# EasyEDA schematic Sheet_1.json
TITLE: Sheet_1; REV: 1.0; Date: 2024-01-25; Sheet: 1/1; Drawn By: reyessanchezo; Company: Your Company
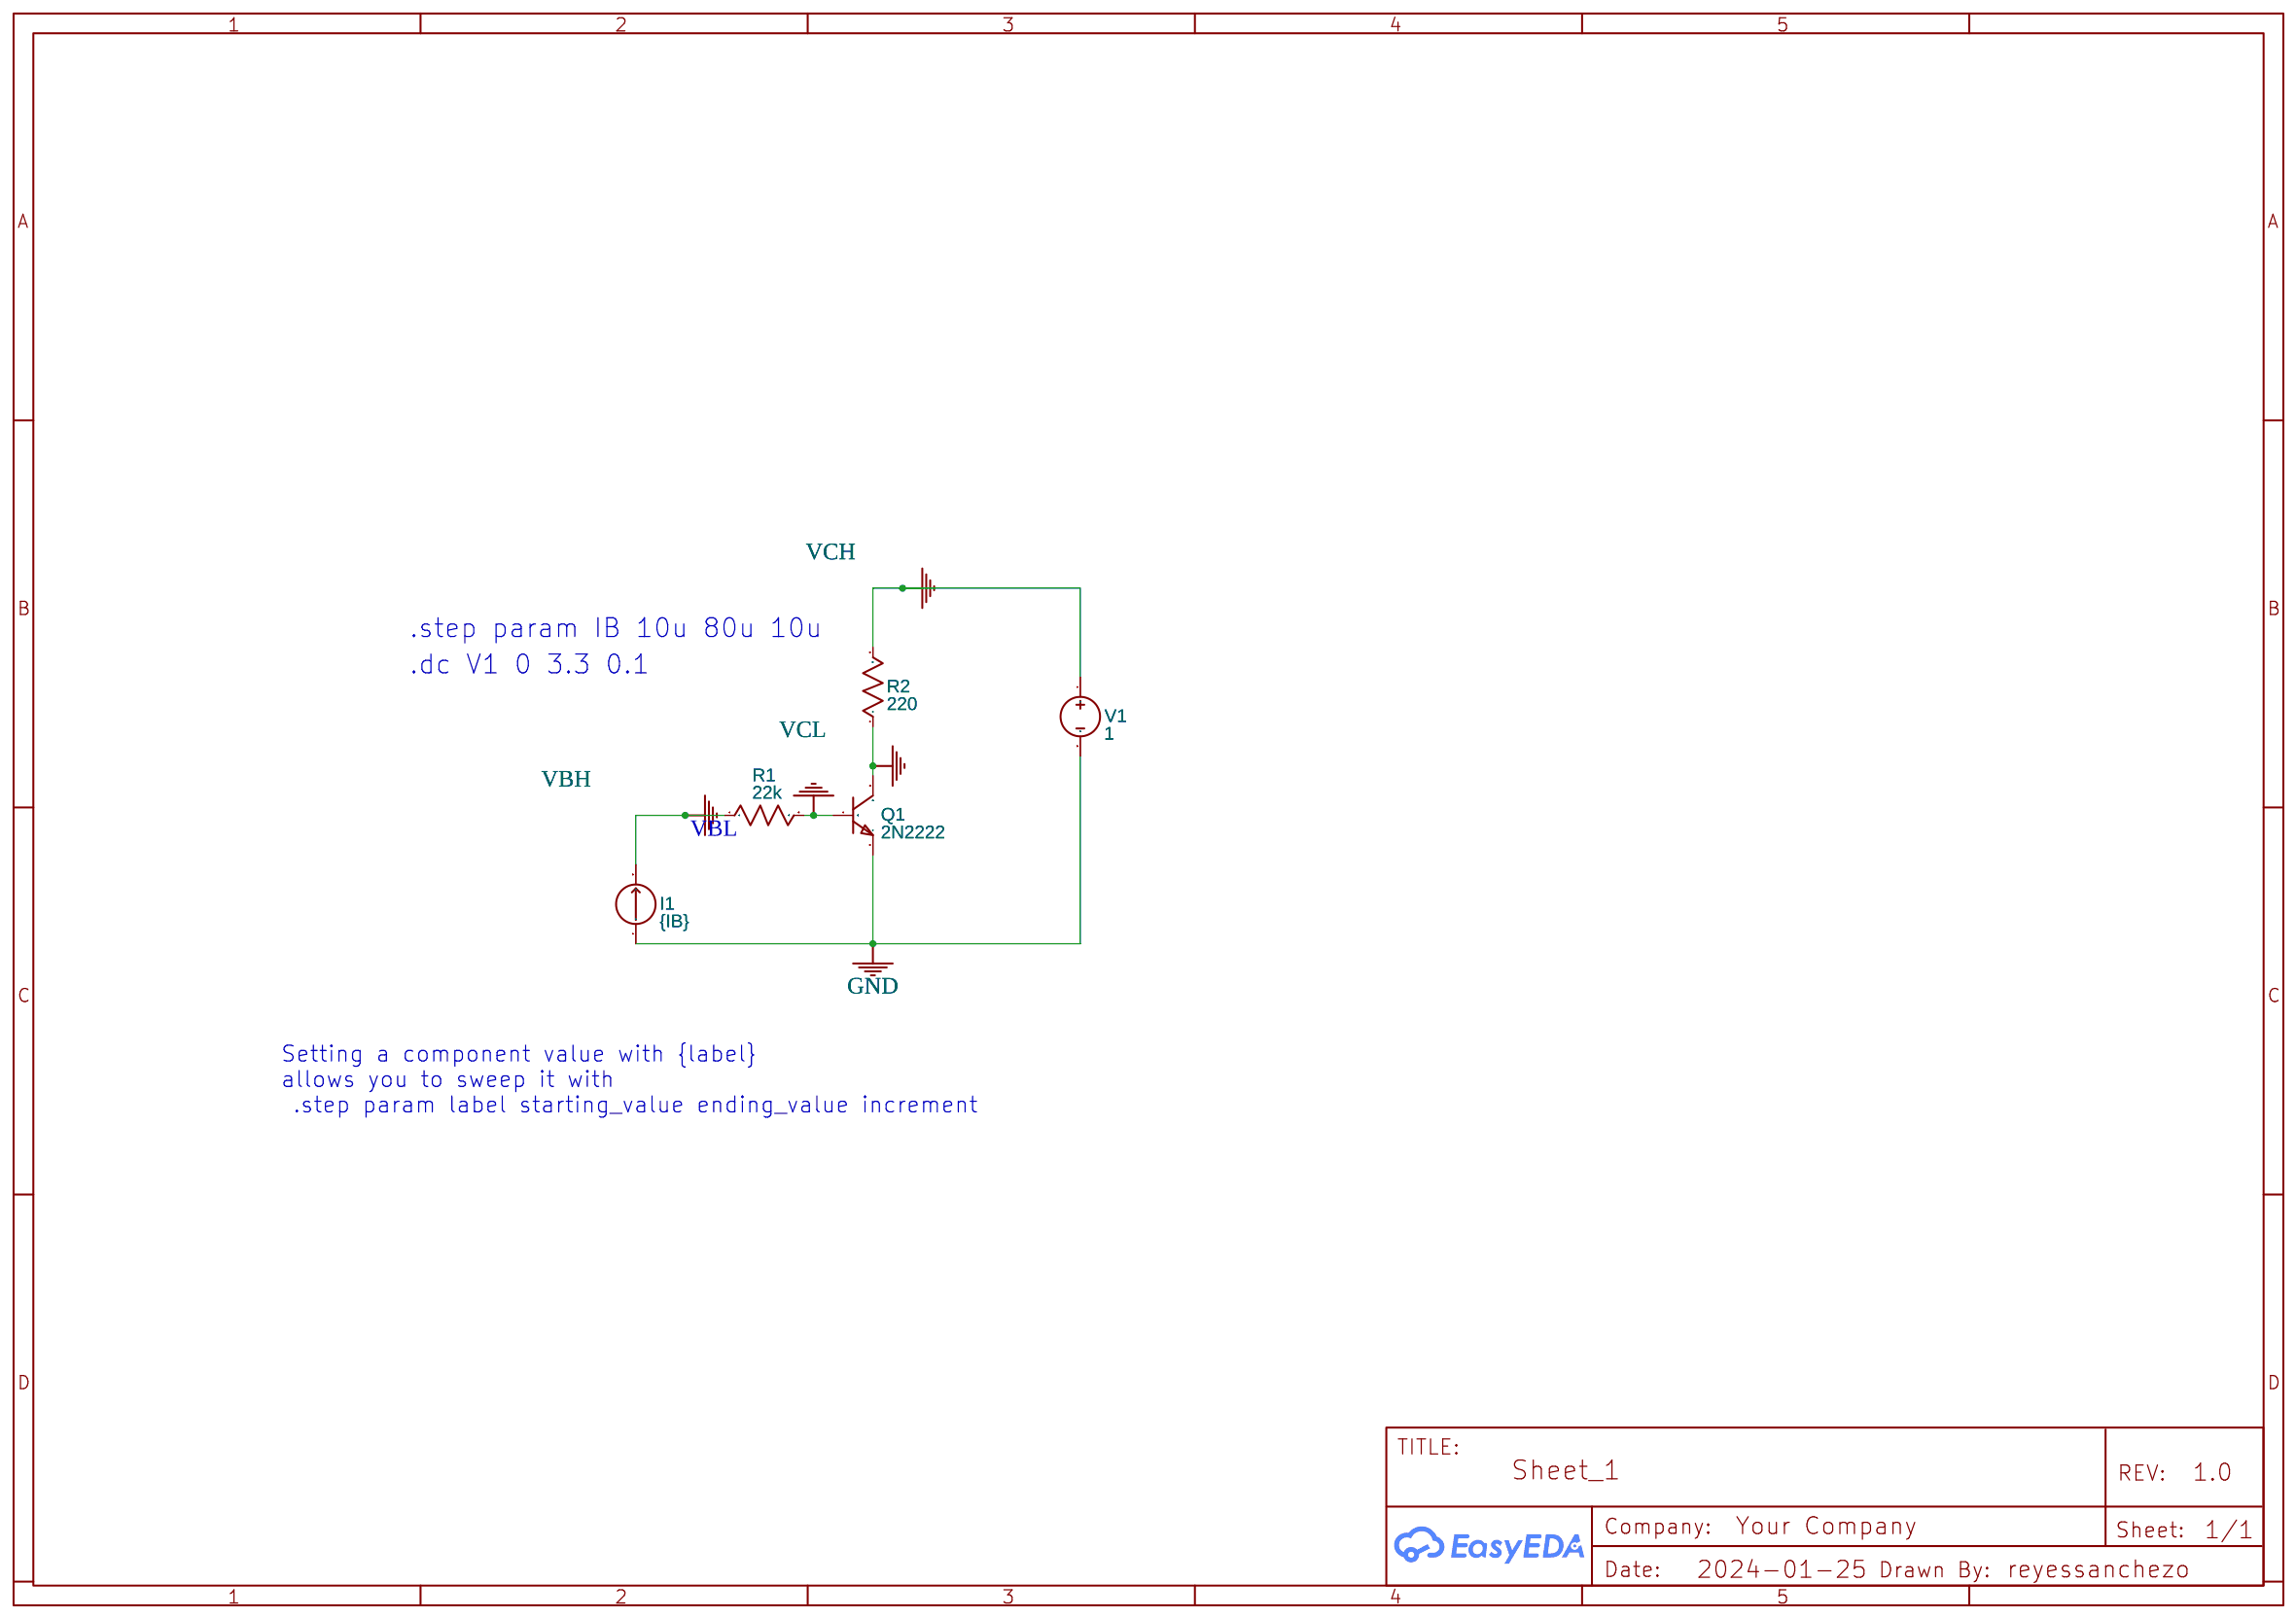
[diagram p0: schematic sheet]

## Parts
I1  {IB}  [2P-5.08]
Q1  2N2222
R1  22k  [AXIAL-0.3]
R2  220  [AXIAL-0.3]
V1  1  [HDR1X2]

## Library data of the parts
I1 = IDC: Contributor: EasyEDA; sim: true
Q1 = 2N2222: Contributor: EasyEDA
R1 R2 = Resistor_US: Resistance: 1k; Contributor: EasyEDA; Supplier: YUJING
V1 = VDC: Contributor: EasyEDA; sim: true

## Nets
GND: I1.1 Q1.2(E) V1.2
VBH: I1.2 R1.1
VBL: Q1.1(B) R1.2
VCH: R2.2 V1.1
VCL: Q1.3(C) R2.1

## Notes on the sheet
- .step param IB 10u 80u 10u
- .dc V1 0 3.3 0.1
- Setting a component value with {label}
  allows you to sweep it with
   .step param label starting_value ending_value increment
